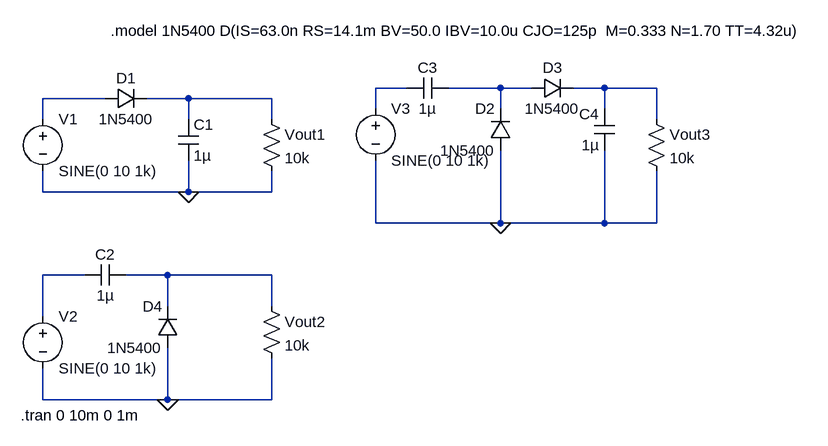
[diagram p0: schematic Lab3_1.asc]
Lab3_1.asc, the LTspice schematic file:
Version 4
SHEET 1 2748 680
WIRE 544 -16 496 -16
WIRE 688 -16 608 -16
WIRE 736 -16 688 -16
WIRE 848 -16 800 -16
WIRE 928 -16 848 -16
WIRE 80 0 -16 0
WIRE 208 0 144 0
WIRE 336 0 208 0
WIRE 496 16 496 -16
WIRE 688 16 688 -16
WIRE 848 16 848 -16
WIRE -16 32 -16 0
WIRE 208 32 208 0
WIRE 336 32 336 0
WIRE 928 32 928 -16
WIRE -16 144 -16 112
WIRE 208 144 208 96
WIRE 208 144 -16 144
WIRE 336 144 336 112
WIRE 336 144 208 144
WIRE 496 192 496 96
WIRE 688 192 688 80
WIRE 688 192 496 192
WIRE 848 192 848 80
WIRE 848 192 688 192
WIRE 928 192 928 112
WIRE 928 192 848 192
WIRE 48 272 -16 272
WIRE 176 272 112 272
WIRE 336 272 176 272
WIRE 176 320 176 272
WIRE 336 320 336 272
WIRE -16 336 -16 272
WIRE -16 464 -16 416
WIRE 176 464 176 384
WIRE 176 464 -16 464
WIRE 336 464 336 400
WIRE 336 464 176 464
FLAG 208 144 0
FLAG 176 464 0
FLAG 688 192 0
SYMBOL voltage -16 16 R0
WINDOW 123 0 0 Left 0
WINDOW 39 0 0 Left 0
SYMATTR InstName V1
SYMATTR Value SINE(0 10 1k)
SYMBOL voltage -16 320 R0
WINDOW 123 0 0 Left 0
WINDOW 39 0 0 Left 0
SYMATTR InstName V2
SYMATTR Value SINE(0 10 1k)
SYMBOL voltage 496 0 R0
WINDOW 123 0 0 Left 0
WINDOW 39 0 0 Left 0
SYMATTR InstName V3
SYMATTR Value SINE(0 10 1k)
SYMBOL diode 80 16 R270
WINDOW 0 32 32 VTop 2
WINDOW 3 0 32 VBottom 2
SYMATTR InstName D1
SYMATTR Value 1N5400
SYMBOL diode 704 80 R180
WINDOW 0 24 64 Left 2
WINDOW 3 24 0 Left 2
SYMATTR InstName D2
SYMATTR Value 1N5400
SYMBOL diode 736 0 R270
WINDOW 0 32 32 VTop 2
WINDOW 3 0 32 VBottom 2
SYMATTR InstName D3
SYMATTR Value 1N5400
SYMBOL diode 192 384 R180
WINDOW 0 24 64 Left 2
WINDOW 3 24 0 Left 2
SYMATTR InstName D4
SYMATTR Value 1N5400
SYMBOL cap 192 32 R0
SYMATTR InstName C1
SYMATTR Value 1µ
SYMBOL cap 112 256 R90
WINDOW 0 0 32 VBottom 2
WINDOW 3 32 32 VTop 2
SYMATTR InstName C2
SYMATTR Value 1µ
SYMBOL cap 608 -32 R90
WINDOW 0 0 32 VBottom 2
WINDOW 3 32 32 VTop 2
SYMATTR InstName C3
SYMATTR Value 1µ
SYMBOL cap 864 80 R180
WINDOW 0 24 56 Left 2
WINDOW 3 24 8 Left 2
SYMATTR InstName C4
SYMATTR Value 1µ
SYMBOL res 320 16 R0
SYMATTR InstName Vout1
SYMATTR Value 10k
SYMBOL res 320 304 R0
SYMATTR InstName Vout2
SYMATTR Value 10k
SYMBOL res 912 16 R0
SYMATTR InstName Vout3
SYMATTR Value 10k
TEXT 88 -104 Left 2 !.model 1N5400 D(IS=63.0n RS=14.1m BV=50.0 IBV=10.0u CJO=125p  M=0.333 N=1.70 TT=4.32u)
TEXT -50 488 Left 2 !.tran 0 10m 0 1m

The netlist it stands for:
* Lab3_1.asc
V1 N004 0 SINE(0 10 1k)
V2 N006 0 SINE(0 10 1k)
V3 N001 0 SINE(0 10 1k)
D1 N004 N005 1N5400
D2 0 N002 1N5400
D3 N002 N003 1N5400
D4 0 N007 1N5400
C1 N005 0 1µ
C2 N007 N006 1µ
C3 N002 N001 1µ
C4 0 N003 1µ
R§Vout1 N005 0 10k
R§Vout2 N007 0 10k
R§Vout3 N003 0 10k
.model D D
.lib standard.dio
.model 1N5400 D(IS=63.0n RS=14.1m BV=50.0 IBV=10.0u CJO=125p  M=0.333 N=1.70 TT=4.32u)
.tran 0 10m 0 1m
.backanno
.end